# EAGLE design uc4h gpsmagbaro v0301 (EAGLE 7.5.0)
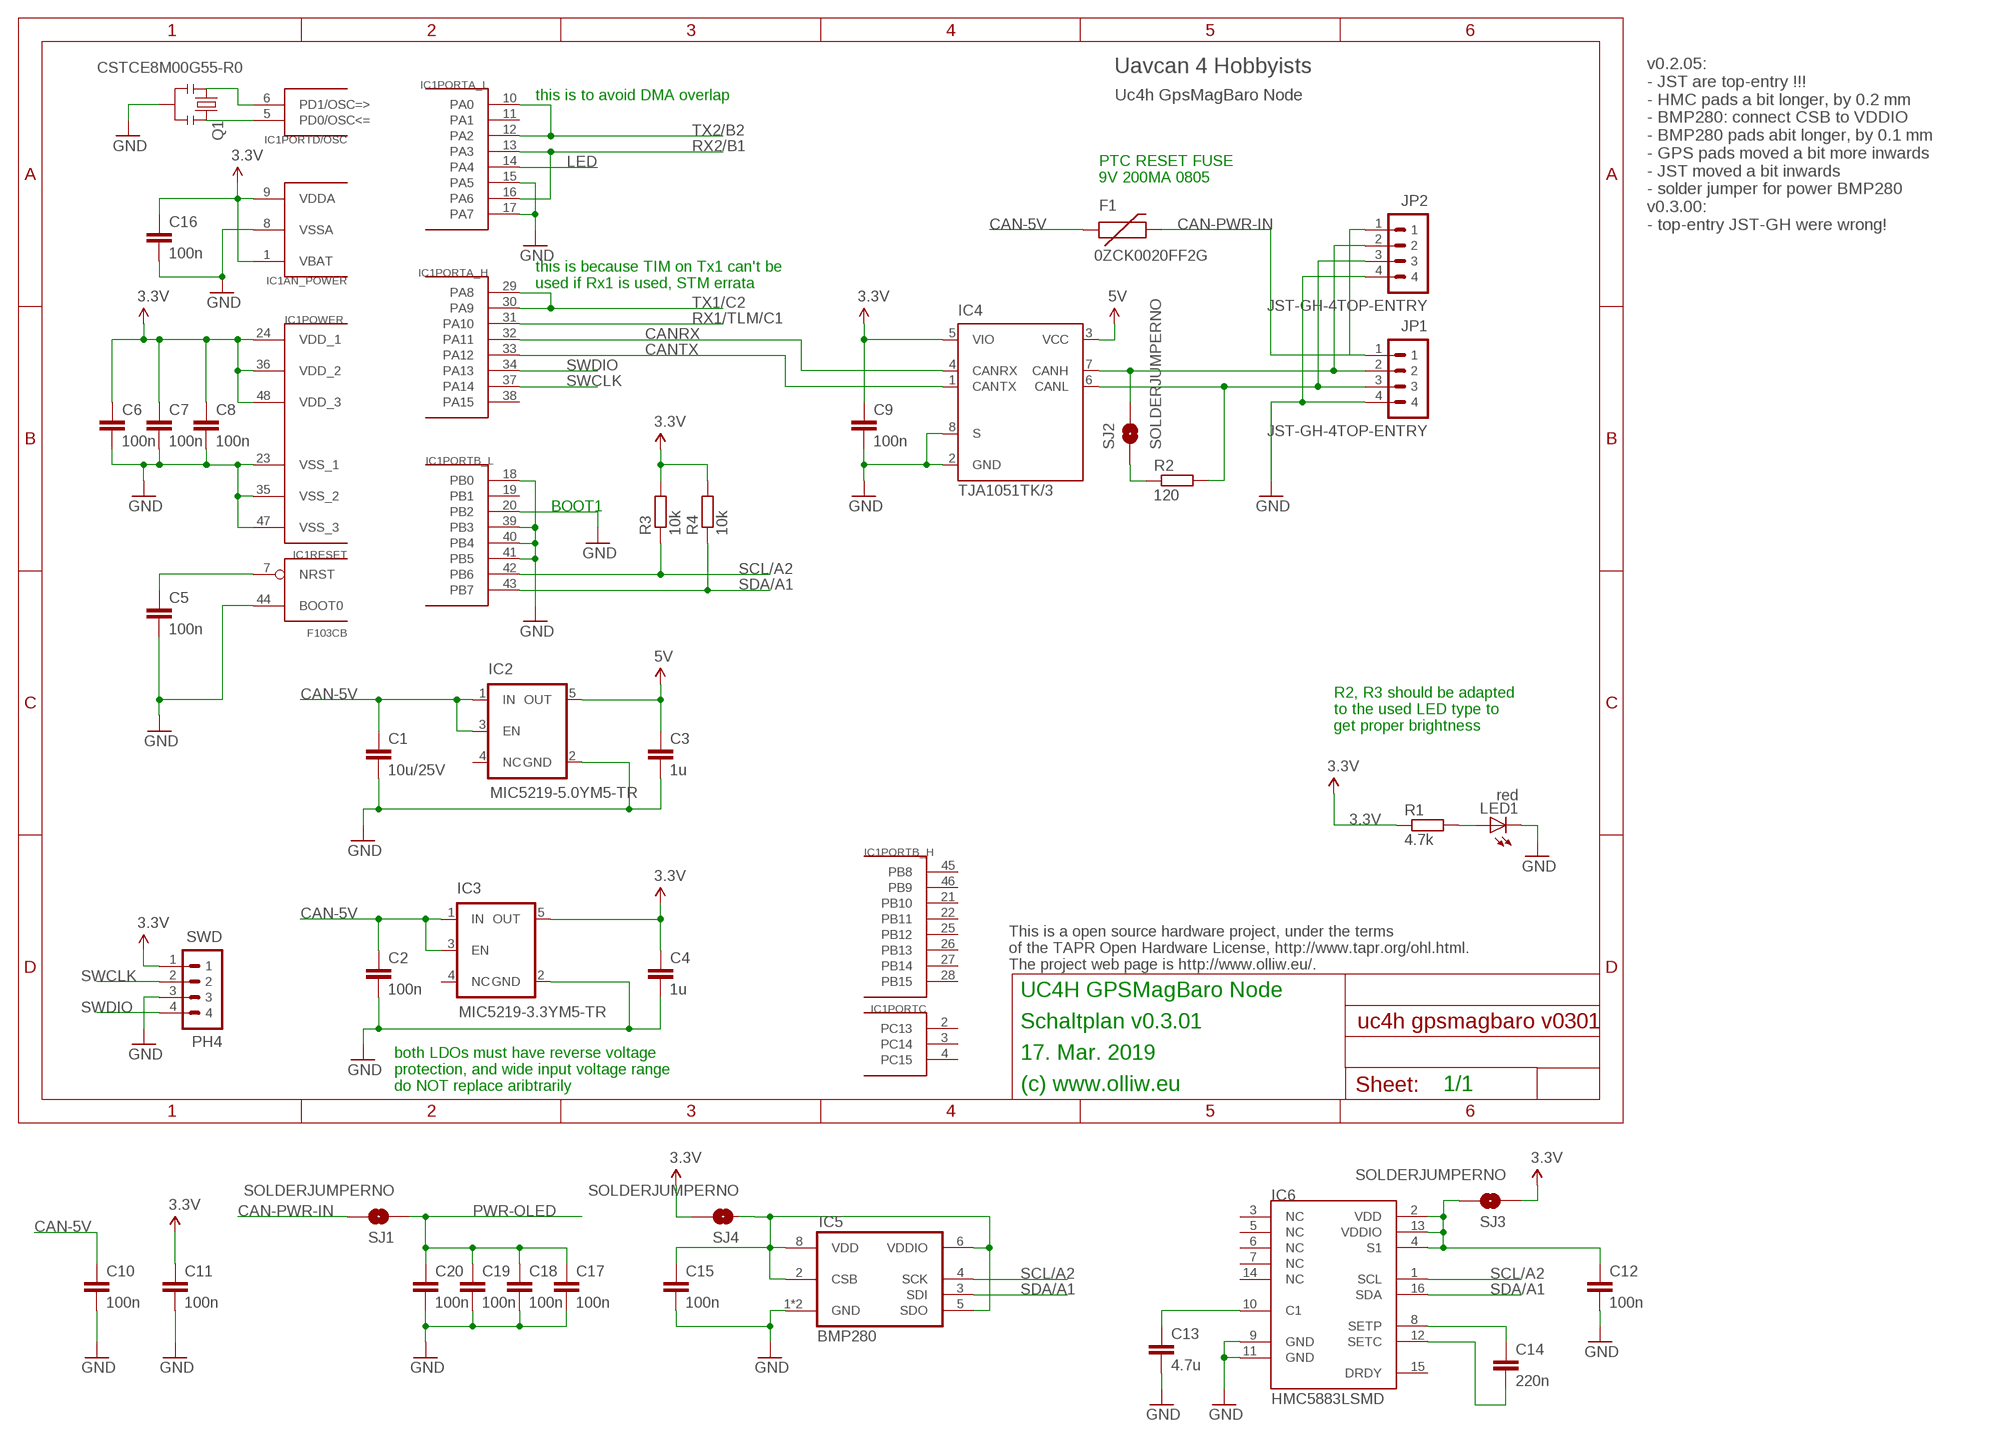
[diagram p0: schematic, sheet 1]

## Parts
C1  10u/25V  C-EUC1206  [C1206]
C2  100n  C-EUC0603K  [C0603K]
C3  1u  C-EUC0603K  [C0603K]
C4  1u  C-EUC0603K  [C0603K]
C5  100n  C-EUC0603K  [C0603K]
C6  100n  C-EUC0603K  [C0603K]
C7  100n  C-EUC0603K  [C0603K]
C8  100n  C-EUC0603K  [C0603K]
C9  100n  C-EUC0603K  [C0603K]
C10  100n  C-EUC0603  [C0603]
C11  100n  C-EUC0603  [C0603]
C12  100n  C-EUC0603  [C0603]
C13  4.7u  C-EUC0805  [C0805]
C14  220n  C-EUC0603  [C0603]
C15  100n  C-EUC0603  [C0603]
C16  100n  C-EUC0603  [C0603]
C17  100n  C-EUC0603  [C0603]
C18  100n  C-EUC0603  [C0603]
C19  100n  C-EUC0603  [C0603]
C20  100n  C-EUC0603  [C0603]
F1  0ZCK0020FF2G  FUSE-PTCFUSE-0805  [FUSE-0805]
IC1  F103CB  STM32F10XCXT6  [TQFP48]
IC2  MIC5219-5.0YM5-TR  V_REG_TPS76433SOT23-5  [SOT23-5]
IC3  MIC5219-3.3YM5-TR  V_REG_TPS76433SOT23-5  [SOT23-5]
IC4  TJA1051TK/3  [HVSON8]
IC5  BMP280  [BMP280]
IC6  HMC5883LSMD  [16LPCC]
JP1  JST-GH-4TOP-ENTRY  [BM04B-GHS-TBT]
JP2  JST-GH-4TOP-ENTRY  [BM04B-GHS-TBT]
LED1  red  LEDCHIPLED_0603  [CHIPLED_0603]
Q1  CSTCE8M00G55-R0  RESONATORSMD  [RESONATOR-SMD]
R1  4.7k  R-EU_R0603  [R0603]
R2  120  R-EU_R0603  [R0603]
R3  10k  R-EU_R0603  [R0603]
R4  10k  R-EU_R0603  [R0603]
SJ1  SOLDERJUMPERNO  [SJ_2S-NO]
SJ2  SOLDERJUMPERNO  [SJ_2S-NO]
SJ3  SOLDERJUMPERNO  [SJ_2S-NO]
SJ4  SOLDERJUMPERNO  [SJ_2S-NO]
SWD  PH4  P4X1_1P27-OCT_BILEX  [4X1_1P27_OCT_BILEX]

## Nets
3.3V: C4.1 C6.1 C7.1 C8.1 C9.1 C11.1 C16.1 IC1.1(AN_POWER:VBAT) IC1.9(AN_POWER:VDDA) IC1.24(POWER:VDD_1) IC1.36(POWER:VDD_2) IC1.48(POWER:VDD_3) IC3.5(OUT) IC4.5(VIO) R1.1 R3.2 R4.2 SJ3.1 SJ4.2 SWD.1
5V: C3.1 IC2.5(OUT) IC4.3(VCC)
CAN-5V: C1.1 C2.1 C10.1 F1.1 IC2.1(IN) IC2.3(EN) IC3.1(IN) IC3.3(EN)
CAN-PWR-IN: F1.2 JP1.1 JP2.1 SJ1.2
CANH: IC4.7(CANH) JP1.2 JP2.2 SJ2.2
CANL: IC4.6(CANL) JP1.3 JP2.3 R2.2
CANRX: IC1.32(PORTA_H:PA11) IC4.4(CANRX)
CANTX: IC1.33(PORTA_H:PA12) IC4.1(CANTX)
GND: C1.2 C2.2 C3.2 C4.2 C5.2 C6.2 C7.2 C8.2 C9.2 C10.2 C11.2 C12.2 C13.2 C15.2 C16.2 C17.2 C18.2 C19.2 C20.2 IC1.8(AN_POWER:VSSA) IC1.15(PORTA_L:PA5) IC1.17(PORTA_L:PA7) IC1.18(PORTB_L:PB0) IC1.20(PORTB_L:PB2) IC1.23(POWER:VSS_1) IC1.35(POWER:VSS_2) IC1.39(PORTB_L:PB3) IC1.40(PORTB_L:PB4) IC1.41(PORTB_L:PB5) IC1.44(RESET:BOOT0) IC1.47(POWER:VSS_3) IC2.2(GND) IC3.2(GND) IC4.2(GND) IC4.8(S) IC5.1(GND) IC5.7(GND) IC6.9(GND) IC6.11(GND) JP1.4 JP2.4 LED1.C Q1.2 SWD.3
LED: IC1.14(PORTA_L:PA4)
N$1: C5.1 IC1.7(RESET:NRST)
N$2: C12.1 IC6.2(VDD) IC6.4(S1) IC6.13(VDDIO) SJ3.2
N$4: R2.1 SJ2.1
N$5: IC1.6(PORTD/OSC:PD1/OSC=>) Q1.1
N$6: IC1.5(PORTD/OSC:PD0/OSC<=) Q1.3
N$7: C14.1 IC6.8(SETP)
N$8: C15.1 IC5.2(CSB) IC5.5(SDO) IC5.6(VDDIO) IC5.8(VDD) SJ4.1
N$9: LED1.A R1.2
N$10: C14.2 IC6.12(SETC)
N$11: C13.1 IC6.10(C1)
PWR-OLED: C17.1 C18.1 C19.1 C20.1 SJ1.1
RX1/TLM/C1: IC1.31(PORTA_H:PA10)
RX2/B1: IC1.13(PORTA_L:PA3) IC1.16(PORTA_L:PA6)
SCL/A2: IC1.42(PORTB_L:PB6) IC5.4(SCK) IC6.1(SCL) R3.1
SDA/A1: IC1.43(PORTB_L:PB7) IC5.3(SDI) IC6.16(SDA) R4.1
SWCLK: IC1.37(PORTA_H:PA14) SWD.2
SWDIO: IC1.34(PORTA_H:PA13) SWD.4
TX1/C2: IC1.29(PORTA_H:PA8) IC1.30(PORTA_H:PA9)
TX2/B2: IC1.10(PORTA_L:PA0) IC1.12(PORTA_L:PA2)
Unconnected: IC1.2(PORTC:PC13) IC1.3(PORTC:PC14) IC1.4(PORTC:PC15) IC1.11(PORTA_L:PA1) IC1.19(PORTB_L:PB1) IC1.21(PORTB_H:PB10) IC1.22(PORTB_H:PB11) IC1.25(PORTB_H:PB12) IC1.26(PORTB_H:PB13) IC1.27(PORTB_H:PB14) IC1.28(PORTB_H:PB15) IC1.38(PORTA_H:PA15) IC1.45(PORTB_H:PB8) IC1.46(PORTB_H:PB9) IC2.4(NC) IC3.4(NC) IC6.3(NC) IC6.5(NC) IC6.6(NC) IC6.7(NC) IC6.14(NC) IC6.15(DRDY)

## Notes on the sheet
- v0.2.05:
  - JST are top-entry !!!
  - HMC pads a bit longer, by 0.2 mm
  - BMP280: connect CSB to VDDIO
  - BMP280 pads abit longer, by 0.1 mm
  - GPS pads moved a bit more inwards
  - JST moved a bit inwards
  - solder jumper for power BMP280
  v0.3.00:
  - top-entry JST-GH were wrong!
- Uavcan 4 Hobbyists
- Uc4h GpsMagBaro Node
- this is to avoid DMA overlap
- PTC RESET FUSE
  9V 200MA 0805
- this is because TIM on Tx1 can't be
  used if Rx1 is used, STM errata
- BOOT1
- R2, R3 should be adapted
  to the used LED type to
  get proper brightness
- This is a open source hardware project, under the terms
  of the TAPR Open Hardware License, http://www.tapr.org/ohl.html.
  The project web page is http://www.olliw.eu/.
- UC4H GPSMagBaro Node
- Schaltplan v0.3.01
- 17. Mar. 2019
- both LDOs must have reverse voltage
  protection, and wide input voltage range
  do NOT replace aribtrarily
- (c) www.olliw.eu | 1/1

## Library data of the parts
C1-C20 = rcl:C-EU: CAPACITOR, European symbol
F1 = # stdlib:FUSE-PTC
IC1 = # stm32:STM32F10XCXT6: ST STM32F101/103 48pin LQFP
IC2 IC3 = # SparkFun2:V_REG_TPS76433: Voltage Regulator Older TI part. LDO 150mA regulator. No output by-pass cap option. See V_REG_LDO for a better part.
IC4 = # stdlib:TJA1051TK/3
IC5 = bosch-bmp280:BMP280: The BMP280 is an absolute barometric pressure sensor. The library has been designed by Richard Magdycz <https://www.facebook.com/groups/eaglecadsoftUK>
IC6 = # SparkFun2:HMC5883L: 3 Axis Digital Compass IC
JP1 JP2 = # stdlib:JST-GH-4
LED1 = led:LED: LED OSRAM: - CHIPLED LG R971, LG N971, LY N971, LG Q971, LY Q971, LO R971, LY R971 LH N974, LH R974 LS Q976, LO Q976, LY Q976 LO Q996 - Hyper CHIPLED LW Q18S LB Q993, LB Q99A, LB R99A - SideLED LS A670, LO A670, LY A670, LG A670, LP A670 LB A673, LV A673, LT A673, LW A673 LH A674 LY A675 LS A676, LA A676, LO A676, LY A676, LW A676 LS A679, LY A679, LG A679 - Hyper Micro SIDELED® LS Y876, LA Y876, LO Y876, LY Y876 LT Y87S - SmartLED LW L88C, LW L88S LB L89C, LB L89S, LG L890 LS L89K, LO L89K, LY L89K LS L896, LA L896, LO L896, LY L896 - TOPLED LS T670, LO T670, LY T670, LG T670, LP T670 LSG T670, LSP T670, LSY T670, LOP T670, LYG T670 LG T671, LOG T671, LSG T671 LB T673, LV T673, LT T673, LW T673 LH T674 LS T676, LA T676, LO T676, LY T676, LB T676, LH T676, LSB T676, LW T676 LB T67C, LV T67C, LT T67C, LS T67K, LO T67K, LY T67K, LW E67C LS E67B, LA E67B, LO E67B, LY E67B, LB E67C, LV E67C, LT E67C LW T67C LS T679, LY T679, LG T679 LS T770, LO T770, LY T770, LG T770, LP T770 LB T773, LV T773, LT T773, LW T773 LH T774 LS E675, LA E675, LY E675, LS T675 LS T776, LA T776, LO T776, LY T776, LB T776 LHGB T686 LT T68C, LB T68C - Hyper Mini TOPLED® LB M676 - Mini TOPLED Santana® LG M470 LS M47K, LO M47K, LY M47K Source: http://www.osram.convergy.de LUXEON: - LUMILED® LXK2-PW12-R00, LXK2-PW12-S00, LXK2-PW14-U00, LXK2-PW14-V00 LXK2-PM12-R00, LXK2-PM12-S00, LXK2-PM14-U00 LXK2-PE12-Q00, LXK2-PE12-R00, LXK2-PE12-S00, LXK2-PE14-T00, LXK2-PE14-U00 LXK2-PB12-K00, LXK2-PB12-L00, LXK2-PB12-M00, LXK2-PB14-N00, LXK2-PB14-P00, LXK2-PB14-Q00 LXK2-PR12-L00, LXK2-PR12-M00, LXK2-PR14-Q00, LXK2-PR14-R00 LXK2-PD12-Q00, LXK2-PD12-R00, LXK2-PD12-S00 LXK2-PH12-R00, LXK2-PH12-S00 LXK2-PL12-P00, LXK2-PL12-Q00, LXK2-PL12-R00 Source: www.luxeon.com KINGBRIGHT: KA-3528ASYC Source: www.kingbright.com
Q1 = # SparkFun2:RESONATOR: Resonator Small SMD resonator. This is the itty bitty 10/20MHz resonators with built in caps. CSTCE10M0G55 and CSTCE20M0V53. Footprint has been reviewed closely but hasn't been tested yet.
R1-R4 = rcl:R-EU_: RESISTOR, European symbol
SJ1-SJ4 = # SparkFun2:SOLDERJUMPER: Solder Jumper Standard SMD solder jumper. Used to automate production. Two varients : Normally Open and Normally Closed are the same, but have different paste layers. NC will have a large amount of paste and should jumper during reflow.
SWD = # stdlib:P4X1_1P27

## Board
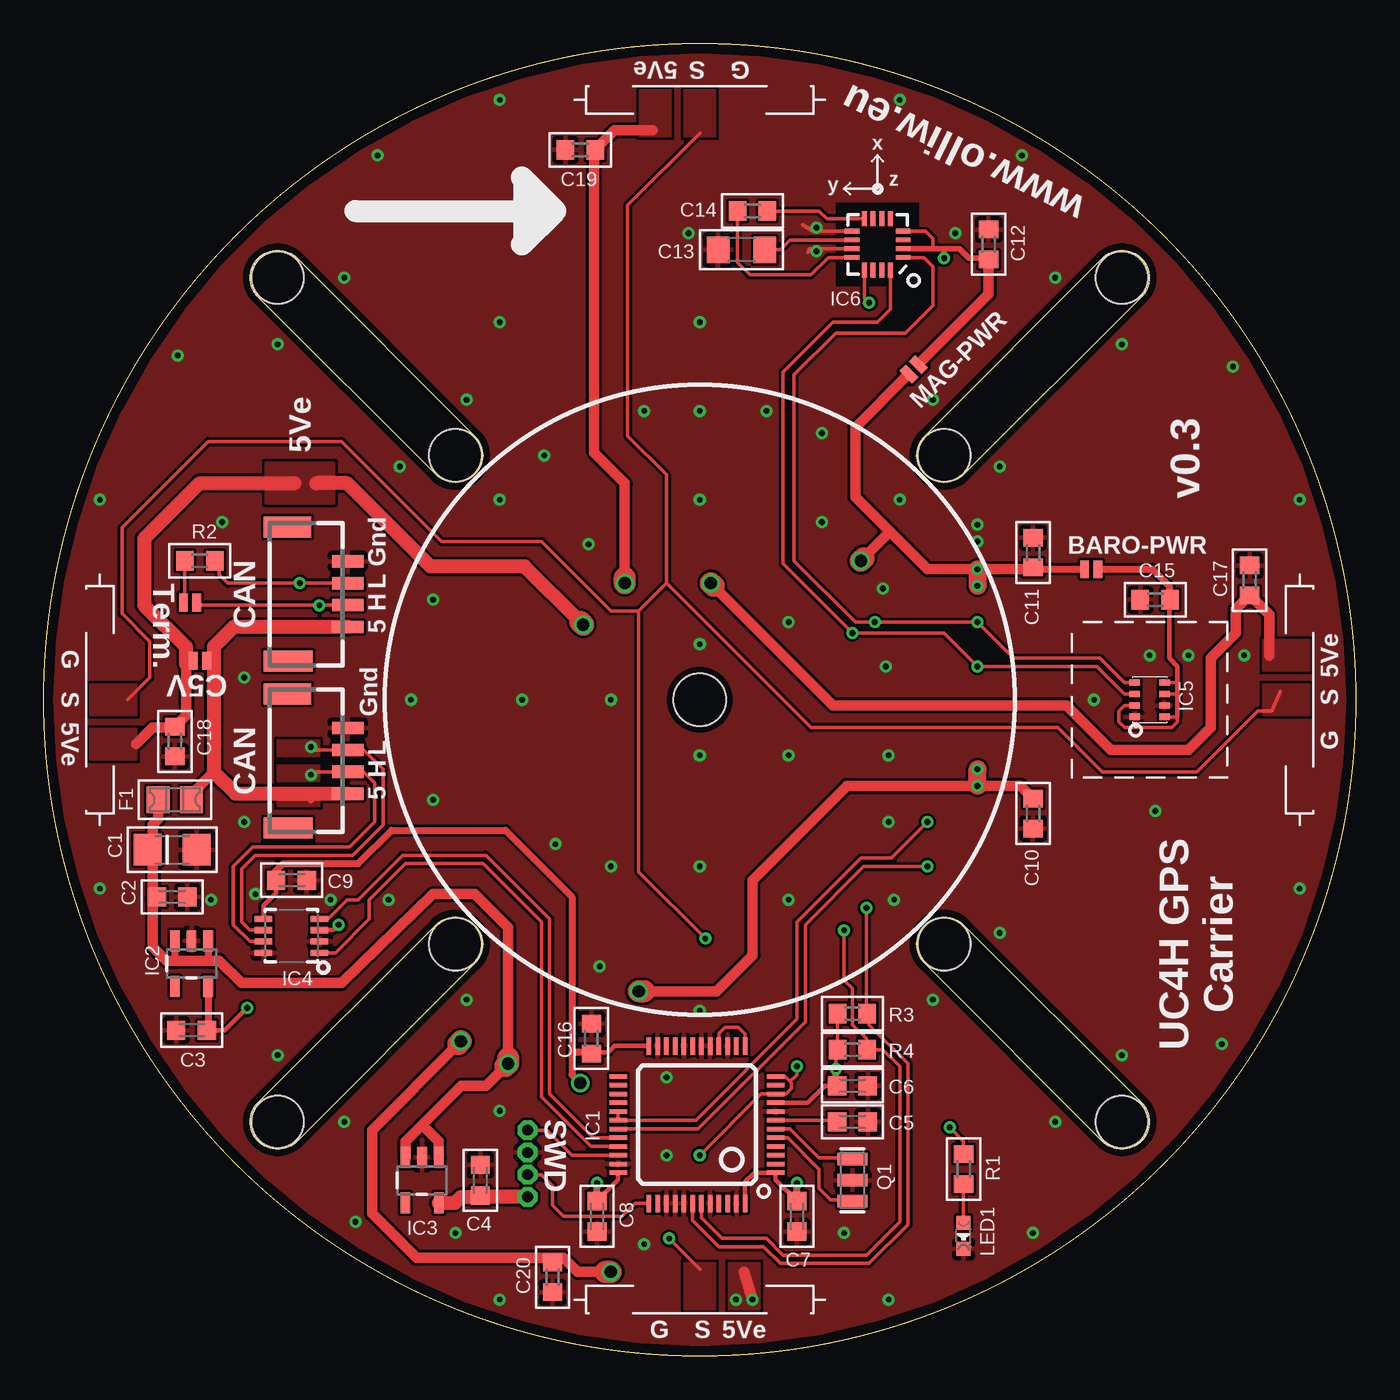
[diagram p1: board, top side]
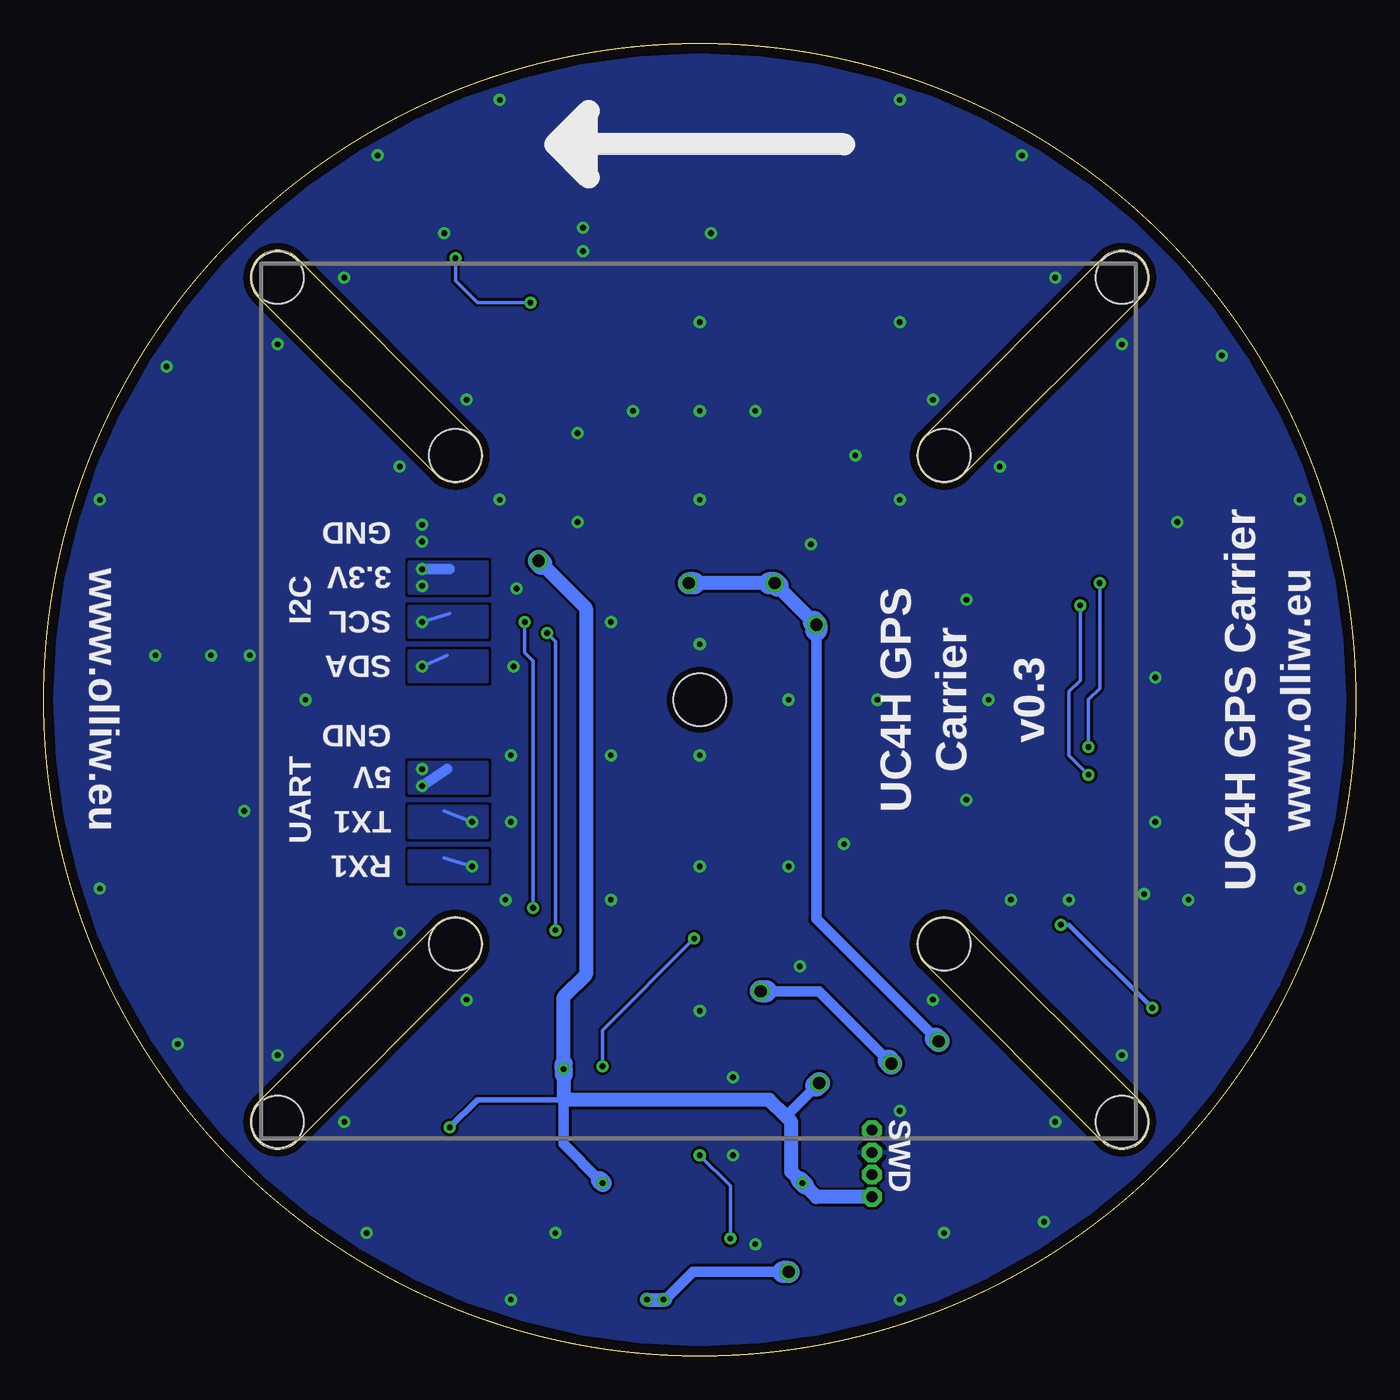
[diagram p2: board, bottom side, seen from below]

Size 75 x 75 mm. Coordinates in mm from the lower left corner, seen from the top.
Outline: 14.48,62.74 24.64,52.58 arc-180 22.42,50.36 12.26,60.52 arc-180 14.48,62.74
Outline: 52.58,24.64 62.74,14.48 arc-180 60.52,12.26 50.36,22.42 arc-180 52.58,24.64
Outline: 50.36,52.58 60.52,62.74 arc-180 62.74,60.52 52.58,50.36 arc-180 50.36,52.58
Outline: 12.26,14.48 22.42,24.64 arc-180 24.64,22.42 14.48,12.26 arc-180 12.26,14.48
Outline: circle at 37.5,37.5 radius 37.5
Copper layers (1*16): Top 0.0356mm / dielectric 1.5011mm / Bottom 0.0356mm
Design rules "ow-oshpark-2layer": minimum track width 6mil, minimum drill 13mil, track to track 6mil, track to pad 6mil, pad to pad 6mil, via to via 6mil, smd to smd 6mil, copper to edge 15mil, drill to drill 6mil, minimum pad ring 7mil, minimum via ring 7mil, stop-mask expansion 2.5mil, vias tented up to drill 26mil, thermal gap 10mil
Holes 3 mm at 37.5,37.5 13.37,61.63 23.53,51.47 51.47,51.47 61.63,61.63 23.53,23.53 13.37,13.37 51.47,23.53 61.63,13.37
tRestrict: area 45.3,61.2 to 50,65.9

### Footprints (pad centres in the part's own frame; a part is rotated, then mirrored left to right if it is on the bottom)
C1206 = smd 1.6 x 1.8: 1 -1.4,0; 2 1.4,0
C0603K = smd 1.05 x 1.08: 1 -0.875,0; 2 0.875,0
C0603 = smd 1 x 1.1: 1 -0.85,0; 2 0.85,0
C0805 = smd 1.3 x 1.5: 1 -1.331,0; 2 1.331,0
FUSE-0805 = smd 1.3 x 1.5: 1 -0.95,0; 2 0.95,0
TQFP48 = smd 0.254 x 1: 1 -2.75,-4.5; 2 -2.25,-4.5; 3 -1.75,-4.5; 4 -1.25,-4.5; 5 -0.75,-4.5; 6 -0.25,-4.5; 7 0.25,-4.5; 8 0.75,-4.5; 9 1.25,-4.5; 10 1.75,-4.5; 11 2.25,-4.5; 12 2.75,-4.5; 25 2.75,4.5; 26 2.25,4.5; 27 1.75,4.5; 28 1.25,4.5; 29 0.75,4.5; 30 0.25,4.5; 31 -0.25,4.5; 32 -0.75,4.5; 33 -1.25,4.5; 34 -1.75,4.5; 35 -2.25,4.5; 36 -2.75,4.5 | smd 1 x 0.254: 13 4.5,-2.75; 14 4.5,-2.25; 15 4.5,-1.75; 16 4.5,-1.25; 17 4.5,-0.75; 18 4.5,-0.25; 19 4.5,0.25; 20 4.5,0.75; 21 4.5,1.25; 22 4.5,1.75; 23 4.5,2.25; 24 4.5,2.75; 37 -4.5,2.75; 38 -4.5,2.25; 39 -4.5,1.75; 40 -4.5,1.25; 41 -4.5,0.75; 42 -4.5,0.25; 43 -4.5,-0.25; 44 -4.5,-0.75; 45 -4.5,-1.25; 46 -4.5,-1.75; 47 -4.5,-2.25; 48 -4.5,-2.75
SOT23-5 = smd 0.55 x 1.2: 1 -0.95,-1.3; 2 0,-1.3; 3 0.95,-1.3; 4 0.95,1.3; 5 -0.95,1.3
HVSON8 = smd 1 x 0.35: 1 -1.6,0.975; 2 -1.6,0.325; 3 -1.6,-0.325; 4 -1.6,-0.975; 5 1.6,-0.975; 6 1.6,-0.325; 7 1.6,0.325; 8 1.6,0.975
BMP280 = smd 0.35 x 0.6: 1 0.975,-0.85; 2 0.325,-0.85; 3 -0.325,-0.85; 4 -0.975,-0.85; 5 -0.975,0.85; 6 -0.325,0.85; 7 0.325,0.85; 8 0.975,0.85
16LPCC = smd 0.85 x 0.28: 1 -1.47,0.75; 2 -1.47,0.25; 3 -1.47,-0.25; 4 -1.47,-0.75; 9 1.47,-0.75; 10 1.47,-0.25; 11 1.47,0.25; 12 1.47,0.75 | smd 0.28 x 0.85: 5 -0.75,-1.47; 6 -0.25,-1.47; 7 0.25,-1.47; 8 0.75,-1.47; 13 0.75,1.47; 14 0.25,1.47; 15 -0.25,1.47; 16 -0.75,1.47
BM04B-GHS-TBT = smd 0.7 x 1.8: 1 1.875,4.8; 2 0.625,4.8; 3 -0.625,4.8; 4 -1.875,4.8 | smd 1.2 x 2.7: FIT@1 -3.825,1.35 | smd 1.2 x 2.8: FIT@2 3.825,1.4
CHIPLED_0603 = smd 0.8 x 0.8: A 0,-0.75; C 0,0.75
RESONATOR-SMD = smd 0.7 x 1.7: 1 -1.2,0; 2 0,0; 3 1.2,0
R0603 = smd 1 x 1.1: 1 -0.85,0; 2 0.85,0
SJ_2S-NO = smd 0.508 x 1.016: 1 -0.381,0; 2 0.381,0
4X1_1P27_OCT_BILEX = drill 0.61 pad 1.118 octagon: 1 0,0; 2 0,-1.27; 3 0,-2.54; 4 0,-3.81

### Placement (x,y rotation side)
C1  7.34,28.93 0 top
C2  7.34,26.23 0 top
C3  8.45,18.61 180 top
C4  24.96,10.04 90 top
C5  46.23,13.37 0 top
C6  46.23,15.43 0 top
C7  43.06,7.97 270 top
C8  31.63,7.97 270 top
C9  14.16,27.18 0 top
C10  56.55,30.99 270 top
C11  56.55,45.91 90 top
C12  54.01,63.54 90 top
C13  39.88,63.22 180 top
C14  40.52,65.44 180 top
C15  63.54,43.21 180 top
C16  31.31,18.13 90 top
C17  68.93,44.33 90 top
C18  7.5,35.12 270 top
C19  30.67,68.93 180 top
C20  29.09,4.48 270 top
F1  7.5,31.78 0 top
IC1  37.34,13.21 90 top
IC2  8.45,22.42 180 top
IC3  21.62,10.04 180 top
IC4  14.16,24.01 180 top
IC5  63.22,37.5 270 top
IC6  47.66,63.54 180 top
JP1  12.58,34.01 270 top
JP2  12.58,43.53 270 top
LED1  52.58,6.86 180 top
Q1  46.23,10.04 270 top
R1  52.58,10.67 270 top
R2  8.92,45.44 0 top
R3  46.23,19.56 180 top
R4  46.23,17.5 180 top
SJ1  8.92,39.72 0 top
SJ2  8.37,43.06 0 top
SJ3  49.72,56.39 45 top
SJ4  59.88,44.96 180 top
SWD  27.66,9.08 180 top

### Tracks (layer width: path | path; a pad name or v marks a point on that pad's centre or on a via)
3.3V  (via drill 0.33, 0.7)
  Top 0.203: R3.2 R4.2 45.28,17.39 v45.28,16.39 | v51.79,13.05 52.58,12.26 R1.1
  Top 0.254: IC1.9 43.67,14.46 44.64,15.43 C6.1 45.28,15.51 | IC1.36 32.84,10.06 C8.1 | C7.1 41.84,10.06 IC1.1 40.62,10.46 40.09,9.93 IC1.48 | IC4.5 12.56,25.74 13.29,26.46 C9.1 13.21,27.26 | IC1.24 32.63,17.71 32.26,17.34 31.57,17.34 | 31.36,17.34 C16.1
  Top 0.406: C7.1 v43.06,9.88 | C8.1 v31.63,9.88 | 30.2,17.34 30.2,26.23 26.39,30.04 19.88,30.04 17.97,28.13 13.69,28.13 13.21,27.66 13.21,27.26 | 30.2,17.34 30.2,16.07 v30.67,15.59 | 31.57,17.34 31.36,17.34 30.2,17.34 | 45.28,15.51 v45.28,16.39 | 49.41,56.07 SJ3.1 | 56.49,44.96 SJ4.2
  Top 0.61: 48.37,47.1 50.52,44.96 v53.38,44.96 56.49,44.96 C11.1 | 48.37,47.1 46.39,49.09 46.39,53.06 49.41,56.07 | 46.87,45.6 48.37,47.1
  Top 0.813: IC3.5 23.5,8.74 23.85,9.08 24.88,9.08 C4.1 25.04,9.08 SWD.1
  Top 1.016: v53.38,44.96 v53.38,44.01
  Top 1.27: v46.71,45.44 46.87,45.6
  Bottom 0.305: v51.79,13.05 50.2,14.64 45.28,14.64
  Bottom 0.61: 45.28,14.64 45.28,12.1 43.21,10.04 | v53.38,44.96 51.79,44.96 | 30.83,15.43 32.58,13.69
  Bottom 0.813: SWD.1 30.83,9.08 31.47,9.72 | 46.55,45.28 44.01,42.74 44.01,21.78 45.28,20.51 45.28,16.7 | 31.78,10.04 32.26,10.51 32.26,13.37 32.58,13.69 33.53,14.64 45.28,14.64 45.28,16.07
  Bottom 1.016: 31.47,9.72 v31.63,9.88 31.78,10.04 | 45.28,16.07 v45.28,16.39 45.28,16.7 | v43.06,9.88 43.21,10.04
  Bottom 1.27: v46.71,45.44 46.55,45.28 | v30.67,15.59 30.83,15.43
  pour Bottom (isolate 0.305, no thermals): 49.64,43.61 54.09,43.61 54.09,45.36 49.64,45.36
5V  (via drill 0.33)
  Top 0.254: IC4.3 16.55,24.33 v16.86,24.64 | 9.4,18.52 C3.1 10.35,18.61 v11.62,19.88
  Top 0.406: IC2.5 9.4,18.52
  Bottom 0.254: v16.86,24.64 16.39,24.64 v11.62,19.88
CAN-5V  (via drill 0.33, 0.7)
  Top 0.406: 6.23,29.22 C1.1 5.91,28.93 6.23,28.77 | 6.23,26.15 C2.1 | IC2.1 9.4,22.57 | 7.65,22.58 7.5,22.73 IC2.3
  Top 0.61: F1.1 6.55,30.68 6.23,30.36 6.23,29.22 | 6.23,28.77 6.23,26.15 | 21.62,13.21 20.67,12.26 IC3.3 | IC3.1 22.57,12.26 21.62,13.21 | C2.1 6.23,26.07 6.23,23.37 7.02,22.58 7.65,22.58 9.08,22.58 9.4,22.57 10.04,22.57 11.31,21.31 17.02,21.31 22.26,26.39 24.64,26.39 26.55,24.48 26.55,17.02 | 21.62,13.21 23.85,15.43 25.28,15.43 26.39,16.54 | 34.32,20.83 38.45,20.83 40.52,22.89 40.52,27.18 45.91,32.58 v53.38,32.58 55.86,32.58 C10.1
  Top 1.016: v53.38,32.58 v53.38,33.53
  Top 1.27: v34.01,20.83 34.32,20.83 | 26.39,16.54 v26.55,16.7 26.55,17.02
  Bottom 0.61: v53.38,32.58 51.95,33.53 | 33.69,20.83 30.67,20.83 26.7,16.86
  Bottom 1.27: v34.01,20.83 33.69,20.83 | v26.55,16.7 26.7,16.86
  pour Bottom (isolate 0.305, no thermals): 49.64,32.18 54.09,32.18 54.09,33.93 49.64,33.93
CAN-PWR-IN
  Top 0.254: SJ1.2 9.24,39.56 9.72,39.72
  Top 0.406: JP1.1 14.93,32.13 15.27,31.78
  Top 0.61: F1.2 8.13,31.78 9.72,33.37
  Top 0.813: JP2.1 10.86,41.66 9.72,40.52 9.72,39.72 9.72,33.37 10.96,32.13 JP1.1
  pour Top (no thermals): 13.37,32.3 13.37,31.43 15.75,31.43 15.75,32.3
CANH  (via drill 0.33)
  Top 0.203: 15.58,42.91 v15.75,42.9 | v15.27,33.21 15.43,33.37 17.23,33.37 | 17.51,33.37 JP1.2 17.23,33.37 | IC4.7 11.79,23.68 10.83,24.64 10.83,27.97 11.94,29.09 17.5,29.09 18.93,30.51 18.93,32.74 18.29,33.37 17.51,33.37 | JP2.2 15.58,42.91 | 15.58,42.91 8.84,42.91 SJ2.2 | 17.51,33.37 17.23,33.37
  Bottom 0.203: v15.75,42.9 15.75,38.61 16.39,37.98 16.39,34.32 v15.27,33.21
  pour Top (no thermals): 13.37,32.86 13.37,33.73 15.75,33.73 15.75,32.86
CANL  (via drill 0.33)
  Top 0.203: 14.49,44.16 v14.64,44.17 | v15.27,34.8 15.42,34.63 JP1.3 17.23,34.64 18.29,34.64 19.4,33.53 19.4,30.36 17.66,28.61 12.1,28.61 11.31,27.82 11.31,24.8 11.77,24.33 IC4.6 | JP2.3 14.49,44.16 | 14.49,44.16 10.52,44.16 10.04,44.64 10.04,45.49 R2.2
  Bottom 0.203: v14.64,44.17 14.64,38.13 15.27,37.5 v15.27,34.8
  pour Top (no thermals): 13.37,34.29 13.37,35.16 15.75,35.16 15.75,34.29
CANRX
  Top 0.203: IC4.4 16.25,24.98 17.34,26.07 17.97,26.07 20.51,28.61 25.28,28.61 28.93,24.96 28.93,14.96 31.42,12.46 IC1.32
CANTX
  Top 0.203: IC4.1 16.68,23.03 18.61,24.96 18.61,26.07 20.67,28.13 25.12,28.13 28.45,24.8 28.45,14.8 31.29,11.96 IC1.33
GND  (via drill 0.33)
  Top 0.203: IC6.9 43.96,64.28 43.37,64.65 | IC6.11 43.76,63.28 43.69,63.06
  other vias: 44.17,64.49 44.17,63.14 36.87,64.17 52.1,64.17 37.5,54.01 20.99,37.5 37.5,19.72 26.07,48.93 48.93,48.93 48.61,26.07 29.24,29.24 44.48,52.74 22.26,43.21 22.26,31.78 31.78,22.26 28.61,51.47 34.32,54.01 41.31,54.01 42.58,26.07 54.64,24.16 61.63,17.18 50.84,20.35 57.82,13.37 24.16,20.35 17.18,13.37 13.37,17.18 19.72,26.07 26.07,14 23.53,7.02 35.59,11.46 35.59,15.91 34.32,6.38 45.75,7.02 20.35,50.84 24.16,54.64 13.37,57.82 17.18,61.63 50.84,54.64 54.64,50.84 61.63,57.82 57.82,61.63 65.44,40.04 71.79,48.93 71.79,26.7 48.3,3.21 26.07,3.21 3.21,26.7 3.21,48.93 26.07,71.79 48.93,71.79 11.46,30.51 11.46,38.77 10.19,47.66 37.5,34.32 32.42,37.5 37.5,40.67 63.22,40.04 63.54,31.15 12.1,26.39 16.39,26.07 9.56,26.07 37.5,59.09 26.07,59.09 27.34,37.5 42.58,34.32 42.58,41.95 37.5,48.93 37.5,27.97 48.3,34.32 44.48,47.66 47.98,43.85 48.14,39.41 48.3,30.51 31.15,46.39 32.42,27.97 19.08,68.62 7.65,57.18 67.98,56.55 67.34,17.81 56.55,7.02 17.81,7.65 53.38,47.5 53.38,46.55 60.04,37.5 55.91,68.62 68.62,40.04
  pour Top (rank 2): 0.67,37.5 arc-90 37.5,74.33 arc-90 74.33,37.5 arc-90 37.5,0.67 arc-90
  pour Bottom (rank 2): 0.67,37.5 arc-90 37.5,74.33 arc-90 74.33,37.5 arc-90 37.5,0.67 arc-90
N$1
  Top 0.203: IC1.7 45.29,13.46 C5.1
N$2  (via drill 0.33)
  Top 0.203: 53.95,62.74 C12.1 | IC6.13 46.91,60.48 v47.18,60.2 | IC6.4 50.4,64.28 50.84,63.85 50.84,63.28
  Top 0.305: IC6.2 50.84,63.28 51.47,63.28 | 51.47,63.28 52.35,63.28 52.9,62.74 53.95,62.74 | v51.47,62.74 51.47,63.28
  Top 0.406: SJ3.2 50.04,56.71
  Top 0.61: C12.1 54.01,60.68 50.04,56.71
  Bottom 0.203: v47.18,60.2 50.2,60.2 51.47,61.47 v51.47,62.74
N$3
  pour Top (no thermals): 45.28,65.92 50.04,65.92 50.04,61.15 45.28,61.15
N$4
  Top 0.203: SJ2.1 8.05,43.06 8.05,45.36 8.07,45.43 R2.1
N$5
  Top 0.203: IC1.6 42.67,12.96 44.33,11.31 45.53,11.31 Q1.1
N$6
  Top 0.203: IC1.5 42.54,12.46 44.33,10.67 44.33,9.56 44.96,8.92 46.3,8.92 Q1.3
N$7
  Top 0.203: C14.1 44.33,65.44 44.76,65 IC6.8
N$8
  Top 0.203: IC5.6 64.8,37.82 64.81,37.82 | IC5.5 64.78,38.48 64.81,38.45 | IC5.2 61.78,37.17 61.47,36.87 61.47,36.23 61.79,35.91 64.49,35.91 64.81,36.23 64.81,36.55 64.78,36.52 IC5.8
  Top 0.254: C15.1 64.34,43.16 64.34,39.88 64.81,39.41 64.81,38.45 64.81,37.82 64.81,36.55
  Top 0.406: SJ4.1 63.38,44.96 64.33,44.01 64.33,43.27 C15.1
N$9
  Top 0.203: LED1.A R1.2
N$10
  Top 0.203: C14.2 39.67,62.48 40.36,61.79 43.85,61.79 44.85,62.78 IC6.12
N$11
  Top 0.203: IC6.10 42.67,63.79 42.1,63.22 C13.1
PWR-OLED  (via drill 0.33, 0.7)
  Top 0.254: SJ1.1 8.13,39.56
  Top 0.61: 28.77,5.59 21.31,5.59 18.77,8.13 18.77,12.89 23.69,17.81 | 5.27,34.96 6.23,35.91 7.12,35.91 C18.1 8.13,36.6 8.13,39.56 | 34.8,70.04 32.63,70.04 C19.1 31.47,68.88 31.47,51.63 33.21,49.88 33.21,44.48 | 70.04,40.04 70.04,42.37 C17.1 68.14,42.68 68.14,41.31 66.71,39.88 66.71,35.91 65.44,34.64 60.99,34.64 58.45,37.18 45.12,37.18 38.29,44.01 | 28.77,5.59 29.72,5.59 30.51,4.8 32.1,4.8 | C20.1 28.77,5.59 | v40.52,3.21 40.04,4.8
  Top 0.813: 8.13,39.56 8.13,40.52 5.75,42.9 5.75,46.71 8.92,49.88 14.32,49.88 | 15.59,49.88 17.34,49.88 22.1,45.12 27.5,45.12 30.67,41.95
  Top 1.27: v30.83,41.79 30.67,41.95 | v33.21,44.17 33.21,44.48 | v38.13,44.17 38.29,44.01 | v23.85,17.97 23.69,17.81 | v32.42,4.8 32.1,4.8
  Bottom 0.61: 30.83,41.47 30.83,24.96 24.01,18.13 | 32.74,4.8 37.9,4.8 39.48,3.21
  Bottom 0.813: 33.53,44.17 37.82,44.17 | 30.99,41.95 33.05,44.01 | v40.52,3.21 39.48,3.21
  Bottom 1.27: 33.53,44.17 v33.21,44.17 33.05,44.01 | 37.82,44.17 v38.13,44.17 | 30.83,41.47 v30.83,41.79 30.99,41.95 | v23.85,17.97 24.01,18.13 | v32.42,4.8 32.74,4.8
  other vias: 39.56,3.21
  pour Top (isolate 0.254, no thermals): 16.54,50.99 12.73,50.99 12.73,48.77 16.54,48.77
  pour Top (isolate 0.254): 39.17,5.27 40.91,5.27 40.91,2.65 39.17,2.65
  pour Top (isolate 0.254): 69.73,39.17 69.73,40.91 72.35,40.91 72.35,39.17
  pour Top (isolate 0.254): 35.83,69.73 34.09,69.73 34.09,72.35 35.83,72.35
  pour Top (isolate 0.254): 5.27,35.83 5.27,34.09 2.65,34.09 2.65,35.83
RX1/TLM/C1  (via drill 0.33)
  Top 0.203: IC1.31 37.41,12.96 43.53,19.08 43.53,24.64 46.87,27.97 v50.52,27.97
  Bottom 0.203: v50.52,27.97 52.1,28.45
  pour Bottom (isolate 0.305, no thermals): 49.64,27.1 54.09,27.1 54.09,28.85 49.64,28.85
RX2/B1
  Top 0.203: IC1.16 38.59,18.43 38.93,18.77 39.72,18.77 40.09,18.4 IC1.13
SCL/A2  (via drill 0.33)
  Top 0.203: IC1.42 37.09,7.75 38.61,6.23 41.15,6.23 42.1,5.27 47.18,5.27 49.41,7.5 49.41,16.7 47.18,18.93 47.18,19.46 R3.1 47.02,19.56 v47.02,25.59 | IC5.4 61.77,38.48 60.36,39.88 55.44,39.88 v53.38,41.95 v47.5,41.95 46.39,41.95 42.9,45.44 42.9,56.07 45.28,58.45 49.25,58.45 50.84,60.04 50.84,62.27 50.31,62.78 IC6.1
  Bottom 0.203: v47.02,25.59 47.02,39.72 47.5,40.2 v47.5,41.95 | v53.38,41.95 51.79,42.42
  pour Bottom (isolate 0.305, no thermals): 49.64,41.07 54.09,41.07 54.09,42.82 49.64,42.82
SDA/A1  (via drill 0.33)
  Top 0.203: IC1.43 37.59,7.88 38.77,6.7 41.31,6.7 42.26,5.75 47.02,5.75 48.93,7.65 48.93,16.54 47.98,17.5 R4.1 47.02,17.55 47.02,18.13 46.23,18.93 46.23,20.99 45.75,21.47 v45.75,24.32 | IC5.3 61.78,37.82 60.2,39.41 v53.38,39.41 51.47,41.31 v46.23,41.31 42.26,45.28 42.26,56.23 45.12,59.09 47.66,59.09 48.41,59.84 IC6.16
  Bottom 0.203: v45.75,24.32 45.75,40.83 v46.23,41.31 | v53.38,39.41 51.95,40.04
  pour Bottom (isolate 0.305, no thermals): 49.64,38.53 54.09,38.53 54.09,40.28 49.64,40.28
SWCLK
  Top 0.203: IC1.37 33.79,8.71 33.05,7.97 29.72,7.97 29.09,8.61 29.09,9.72 28.45,10.35 SWD.2
SWDIO
  Top 0.203: IC1.34 30.36,11.46 30.2,11.46 28.77,12.89 SWD.4
TX1/C2  (via drill 0.33)
  Top 0.203: IC1.29 IC1.30 37.27,13.46 43.06,19.24 43.06,24.8 46.71,28.45 48.45,28.45 v50.52,30.51
  Bottom 0.203: v50.52,30.51 52.1,31.15
  pour Bottom (isolate 0.305, no thermals): 49.64,29.64 54.09,29.64 54.09,31.39 49.64,31.39
TX2/B2  (via drill 0.33)
  Top 0.203: IC1.12 42.37,15.96 42.66,15.67 | 42.66,15.67 42.74,15.59 42.74,15.27 42.42,14.96 IC1.10 41,14.96 v37.5,11.46 | 4.8,37.5 6.07,38.77 6.07,40.83 4.48,42.42 4.48,47.34 9.4,52.26 17.02,52.26 22.74,46.55 28.45,46.55 32.42,42.58 34.01,42.58 | 35.59,44.17 35.59,50.36 33.37,52.58 33.37,65.76 37.5,69.88 | 34.01,42.58 34.01,27.66 v37.82,23.85 | 35.59,44.17 43.85,35.91 57.98,35.91 60.52,33.37 65.92,33.37 69.41,36.87 70.2,36.87 70.68,37.98 | 35.59,44.17 34.01,42.58 | v43.06,16.54 43.06,16.07 42.66,15.67 | 37.5,4.96 v35.75,6.7
  Bottom 0.203: v37.82,23.85 43.06,18.61 v43.06,16.54 | v35.75,6.7 35.75,9.72 v37.5,11.46
  pour Top (isolate 0.254): 36.63,5.27 38.37,5.27 38.37,2.65 36.63,2.65
  pour Top (isolate 0.254): 69.73,36.63 69.73,38.37 72.35,38.37 72.35,36.63
  pour Top (isolate 0.254): 38.37,69.73 36.63,69.73 36.63,72.35 38.37,72.35
  pour Top (isolate 0.254): 5.27,38.37 5.27,36.63 2.65,36.63 2.65,38.37

### Text on the board
tNames: 5Ve | S | G | x | y | z | www.olliw.eu | MAG-PWR | 5Ve | v0.3 | Gnd | BARO-PWR | Term. | CAN | L | H | 5 | G | C5V | S | 5Ve | S | 5Ve | Gnd | CAN | L | G | H | 5 | UC4H GPS | Carrier | SWD | G | S | 5Ve
bNames: GND | 3.3V | I2C | SCL | SDA | www.olliw.eu | UC4H GPS Carrier | v0.3 | Carrier | UC4H GPS | www.olliw.eu | GND | 5V | TX1 | UART | RX1 | SWD